# Altium schematic sheet COVER PAGE.SchDoc
size A3; SheetNumber: 2; SheetTotal: 5
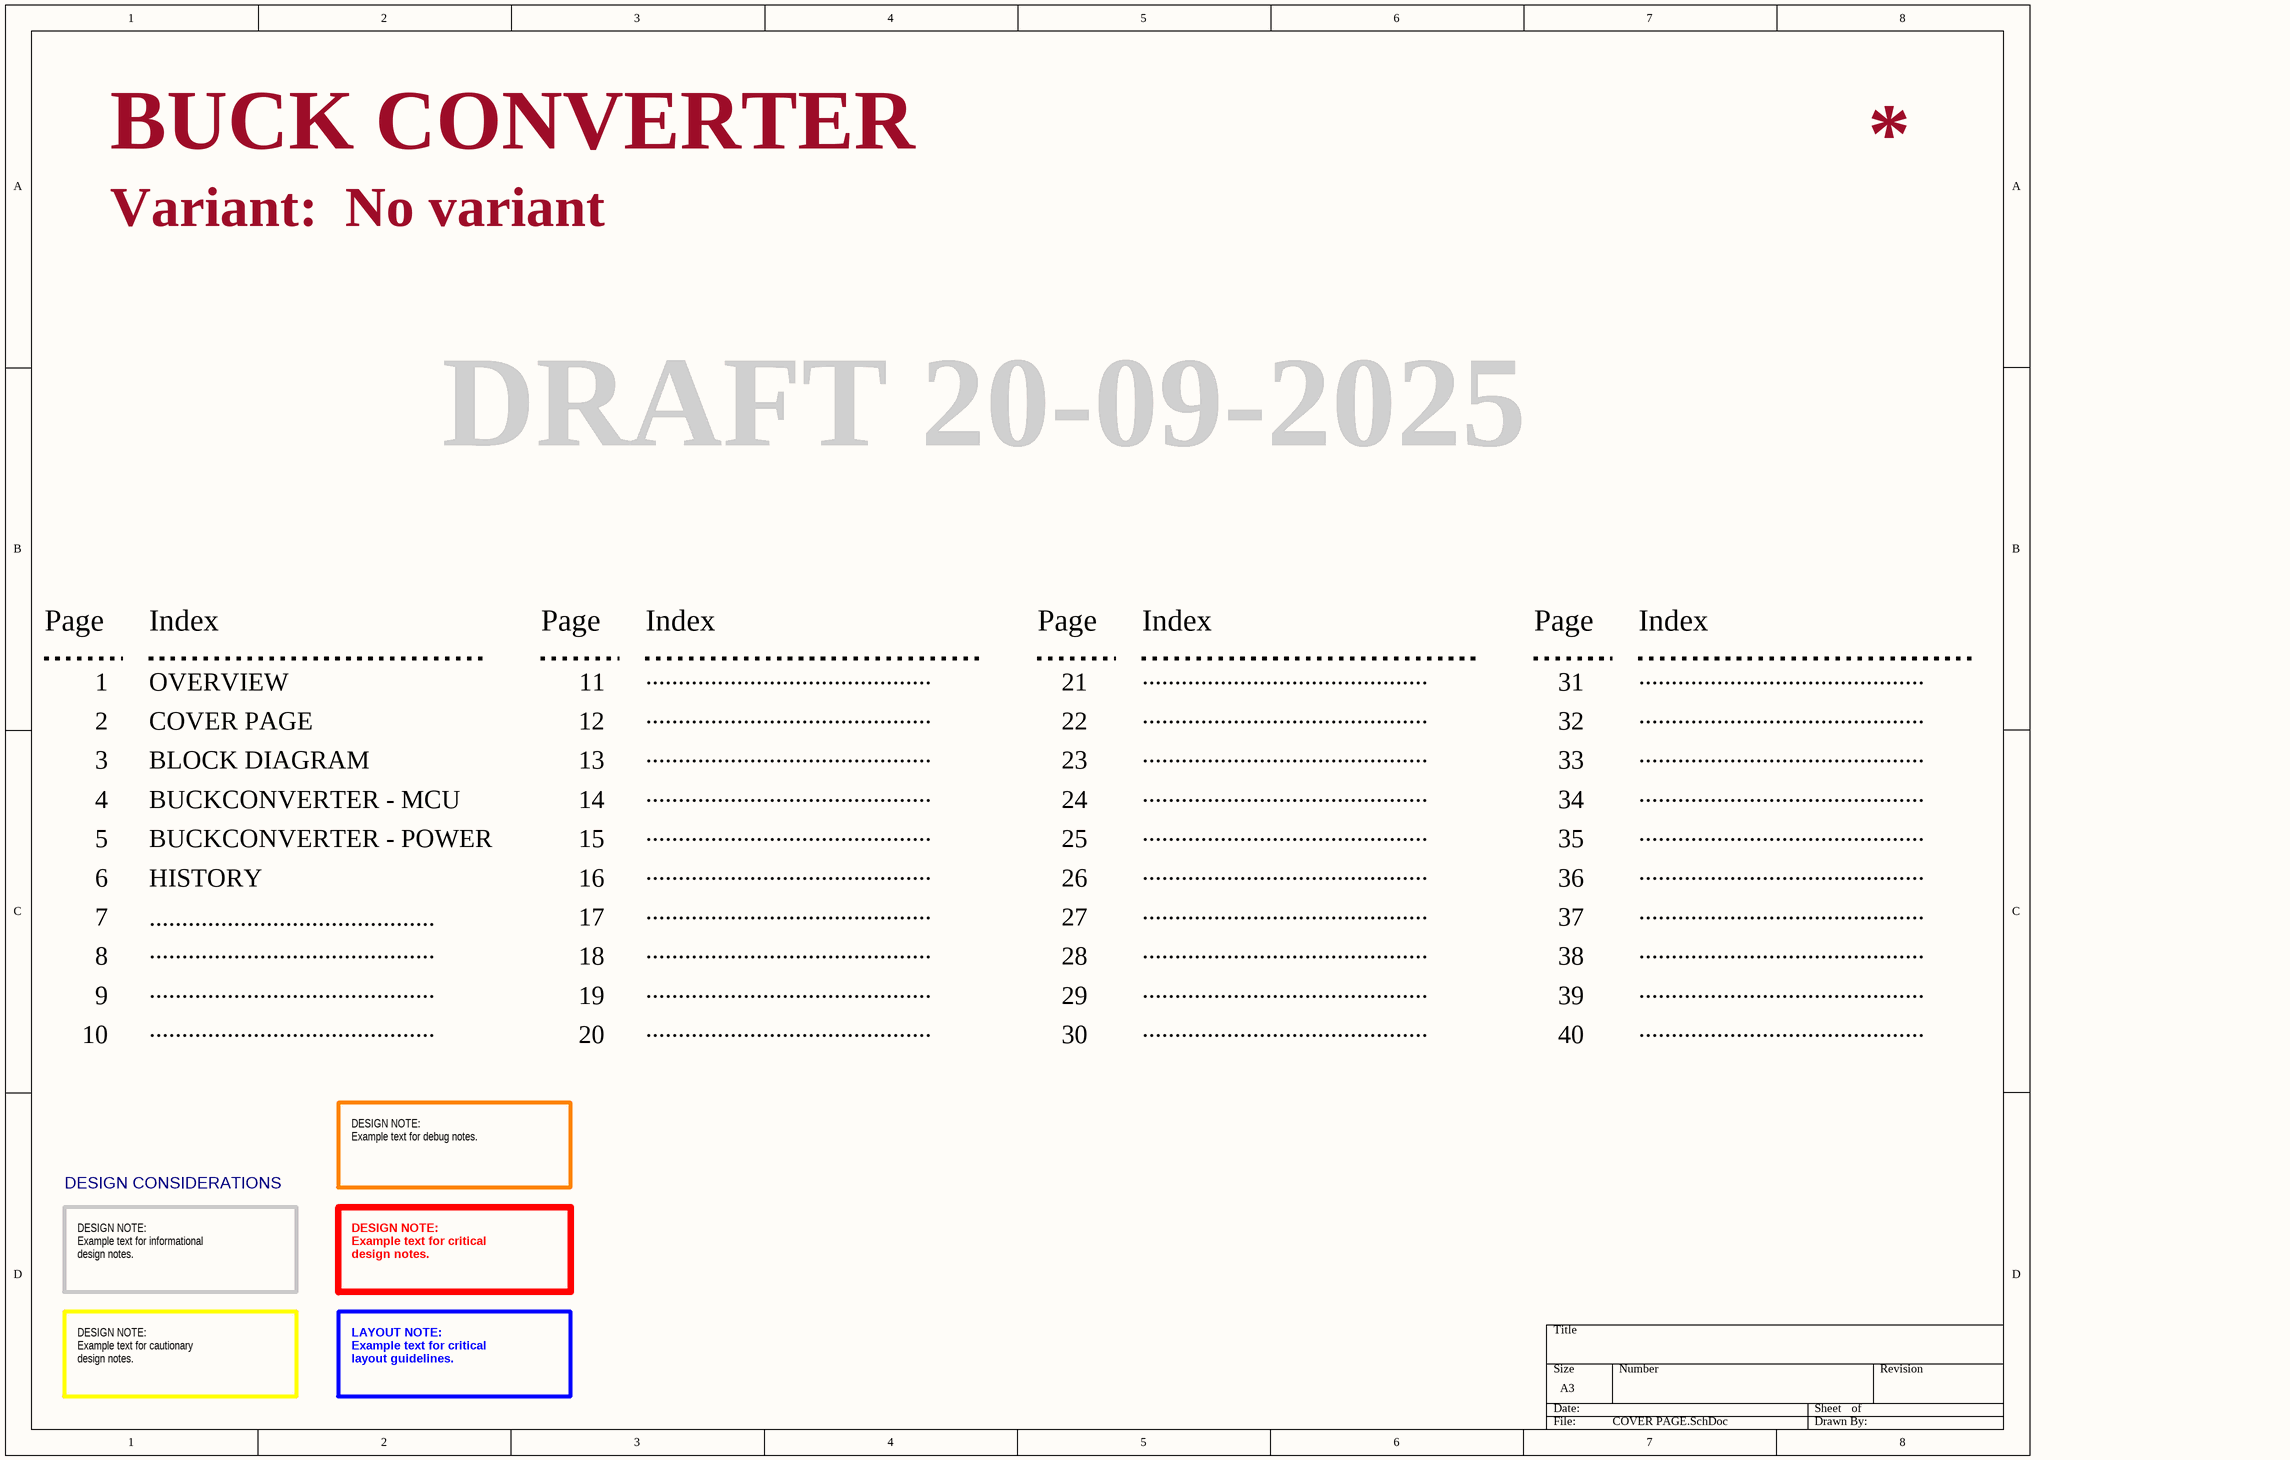
[diagram p0: COVER PAGE.SchDoc]

## Notes on the sheet
- BUCK CONVERTER
- Variant:
- No variant
- DRAFT 20-09-2025
- Page
- 1
- Index
- OVERVIEW
- 11
- ............................................
- 21
- 31
- 2
- COVER PAGE
- 12
- 22
- 32
- 3
- 4
- BLOCK DIAGRAM
- BUCKCONVERTER - MCU
- 13
- 14
- 23
- 24
- 33
- 34
- 5
- 6
- BUCKCONVERTER - POWER
- HISTORY
- 15
- 16
- 25
- 26
- 35
- 36
- 7
- 17
- 27
- 37
- 8
- 9
- 18
- 19
- 28
- 29
- 38
- 39
- 10
- 20
- 30
- 40
- DESIGN CONSIDERATIONS
- DESIGN NOTE:
  Example text for debug notes.
- DESIGN NOTE:
  Example text for informational
  design notes.
- DESIGN NOTE:
  Example text for critical
  design notes.
- DESIGN NOTE:
  Example text for cautionary
  design notes.
- LAYOUT NOTE:
  Example text for critical
  layout guidelines.